# Altium schematic sheet 01_D00173332_TopSheet.SchDoc: -
size A4; PageSetup: Record=PageOptions|CenterHorizontal=True|CenterVertical=True|PrintScale=0.97|XCorrection=1.00|YCorrection=1.00|PrintKind=1|BorderSize=5000000|LeftOffset=0|BottomOffset=0|Orientation=2|PaperLength=1000|PaperWidth=1000|Scale=100|PaperSource=7|PrintQuality=-4|MediaType=1|DitherType=10|PrintScaleMode=1|PaperKind=A4|PaperIndex=9; Date: -; ApprovedBy: -; CheckedBy: -; Author: -; CompanyName: -; DrawnBy: -; Engineer: -; Organization: Komax AG; Address1: -; Address2: -; Address3: -; Address4: -; DocumentNumber: -; Revision: -; SheetNumber: 1; SheetTotal: 8; KSDP_ObjectName: TopSheet; KSDP_CreationDate: 06.12.2017; KSDP_CreatedBy: Patrick Rossacher; KSDP_ModificationDate: -; KSDP_ModifiedBy: -; CurrentTime: -; CurrentDate: -; Time: -; DocumentFullPathAndName: -; DocumentName: -; ModifiedDate: -; ImagePath: -
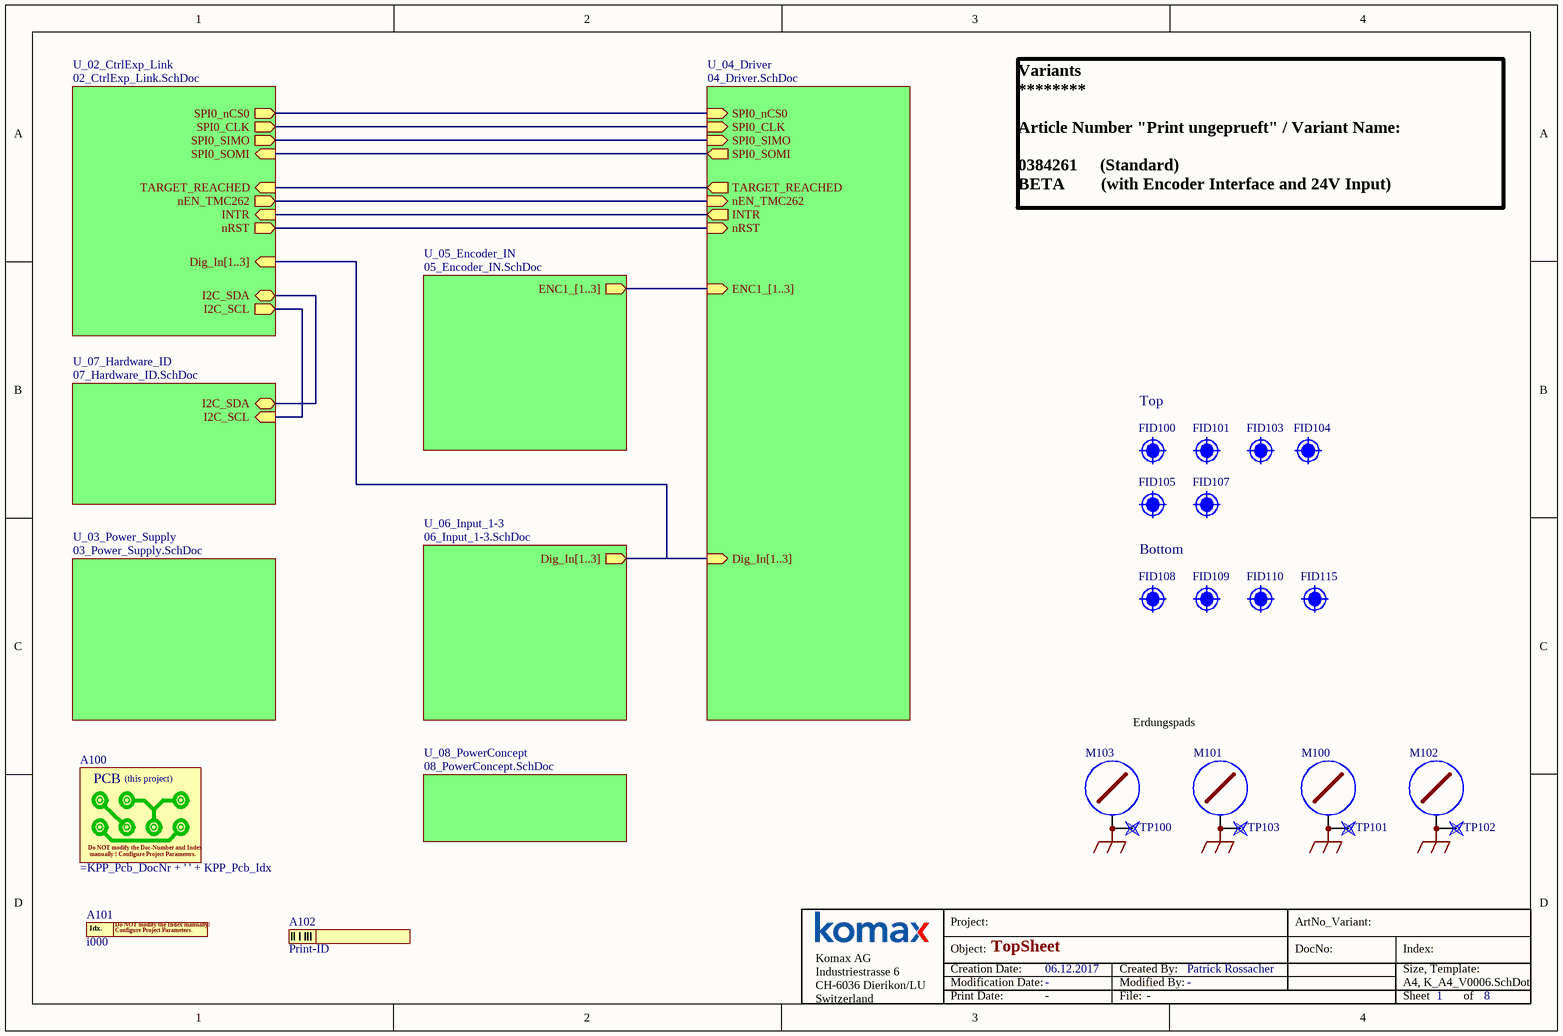
[diagram p0: 01_D00173332_TopSheet.SchDoc]

## Parts
A100  (no value)  (mechanical)
A101  i000  [PrintIndex]
A102  Print-ID  [PrintID]
FID100  Fiducial  [FID_1.1mm]  (value not drawn)  (no BOM)
FID101  Fiducial  [FID_1.1mm]  (value not drawn)  (no BOM)
FID103  Fiducial  [FID_1.1mm]  (value not drawn)  (no BOM)
FID104  Fiducial  [FID_1.1mm]  (value not drawn)  (no BOM)
FID105  Fiducial  [FID_1.1mm]  (value not drawn)  (no BOM)
FID107  Fiducial  [FID_1.1mm]  (value not drawn)  (no BOM)
FID108  Fiducial  [FID_1.1mm]  (value not drawn)  (no BOM)
FID109  Fiducial  [FID_1.1mm]  (value not drawn)  (no BOM)
FID110  Fiducial  [FID_1.1mm]  (value not drawn)  (no BOM)
FID115  Fiducial  [FID_1.1mm]  (value not drawn)  (no BOM)
M100  M4  [M4/4,5/PAD9]  (value not drawn)  (no BOM)
M101  M4  [M4/4,5/PAD9]  (value not drawn)  (no BOM)
M102  M4  [M4/4,5/PAD9]  (value not drawn)  (no BOM)
M103  M4  [M4/4,5/PAD9]  (value not drawn)  (no BOM)
TP100  Testpoint  [TP1.5MM]  (value not drawn)  (no BOM)
TP101  Testpoint  [TP1.5MM]  (value not drawn)  (no BOM)
TP102  Testpoint  [TP1.5MM]  (value not drawn)  (no BOM)
TP103  Testpoint  [TP1.5MM]  (value not drawn)  (no BOM)

## Sub-sheets
U_02_CtrlExp_Link = 02_CtrlExp_Link.SchDoc: I2C_SDA (bidir), I2C_SCL (out), SPI0_nCS0 (out), SPI0_CLK (out), SPI0_SIMO (out), SPI0_SOMI (in), nEN_TMC262 (out), TARGET_REACHED (in), INTR (in), nRST (out), Dig_In[1..3] (in)
U_03_Power_Supply = 03_Power_Supply.SchDoc: no entries
U_04_Driver = 04_Driver.SchDoc: Dig_In[1..3] (in), ENC1_[1..3] (in), SPI0_nCS0 (in), SPI0_CLK (in), SPI0_SIMO (in), SPI0_SOMI (out), nEN_TMC262 (in), TARGET_REACHED (out), INTR (out), nRST (in)
U_05_Encoder_IN = 05_Encoder_IN.SchDoc: ENC1_[1..3] (out)
U_06_Input_1-3 = 06_Input_1-3.SchDoc: Dig_In[1..3] (out)
U_07_Hardware_ID = 07_Hardware_ID.SchDoc: I2C_SDA (bidir), I2C_SCL (in)
U_08_PowerConcept = 08_PowerConcept.SchDoc: no entries

## Nets
SHIELD_1: M103.1 TP100.1
SHIELD_2: M101.1 TP103.1
SHIELD_3: M100.1 TP101.1
SHIELD_4: M102.1 TP102.1
(unnamed): sheet U_02_CtrlExp_Link/I2C_SDA, sheet U_07_Hardware_ID/I2C_SDA
(unnamed): sheet U_02_CtrlExp_Link/I2C_SCL, sheet U_07_Hardware_ID/I2C_SCL
(unnamed): sheet U_02_CtrlExp_Link/SPI0_nCS0, sheet U_04_Driver/SPI0_nCS0
(unnamed): sheet U_02_CtrlExp_Link/SPI0_CLK, sheet U_04_Driver/SPI0_CLK
(unnamed): sheet U_02_CtrlExp_Link/SPI0_SIMO, sheet U_04_Driver/SPI0_SIMO
(unnamed): sheet U_02_CtrlExp_Link/SPI0_SOMI, sheet U_04_Driver/SPI0_SOMI
(unnamed): sheet U_02_CtrlExp_Link/nEN_TMC262, sheet U_04_Driver/nEN_TMC262
(unnamed): sheet U_02_CtrlExp_Link/TARGET_REACHED, sheet U_04_Driver/TARGET_REACHED
(unnamed): sheet U_02_CtrlExp_Link/INTR, sheet U_04_Driver/INTR
(unnamed): sheet U_02_CtrlExp_Link/nRST, sheet U_04_Driver/nRST

## Buses and harness runs
bus sheet U_02_CtrlExp_Link/Dig_In[1..3] = sheet U_04_Driver/Dig_In[1..3] = sheet U_06_Input_1-3/Dig_In[1..3]
bus sheet U_04_Driver/ENC1_[1..3] = sheet U_05_Encoder_IN/ENC1_[1..3]

## Notes on the sheet
- Variants
  ********
  Article Number "Print ungeprueft" / Variant Name:
  0384261     (Standard)
  BETA        (with Encoder Interface and 24V Input)
- Top
- Bottom
- Erdungspads
- Project:
- ArtNo_Variant:
- Object:
- Creation Date:
- Modification Date:
- Created By:
- Modified By:
- DocNo:
- Index:
- Size, Template:
- A4, K_A4_V0006.SchDot
- Komax AG
  Industriestrasse 6
  CH-6036 Dierikon/LU
  Switzerland
- Print Date:
- File:
- Sheet
- of
- (in symbol Kleber Artikel-Index) Do NOT modify the Index manually!; Idx.; Configure Project Parameters.
- (in symbol PCB from project) PCB; (this project); Do NOT modify the Doc-Number and Index; manually ! Configure Project Parameters.

## Library data of the parts
A100 = PCB from project: PCB not assembled
A101 = Kleber Artikel-Index: Etiquette Article-Index; Notes: Positioning and design see assembly instructions
A102 = Kleber Printidentifikation: Etiquette PCB Identification; Notes: Positioning and design see assembly instructions
FID100 FID101 FID103-FID105 FID107-FID110 FID115 = FID: FootprintBOM: Fiducal 1.1mm; Notes: Fiducial
M100-M103 = PAD1: Bohrung mit PAD; Strategic: 0; Bezeichnung: M4
TP100-TP103 = P_PRUEFPAD: FootprintBOM: Testpoint